# EAGLE design top_board_v1 (EAGLE 6.3)
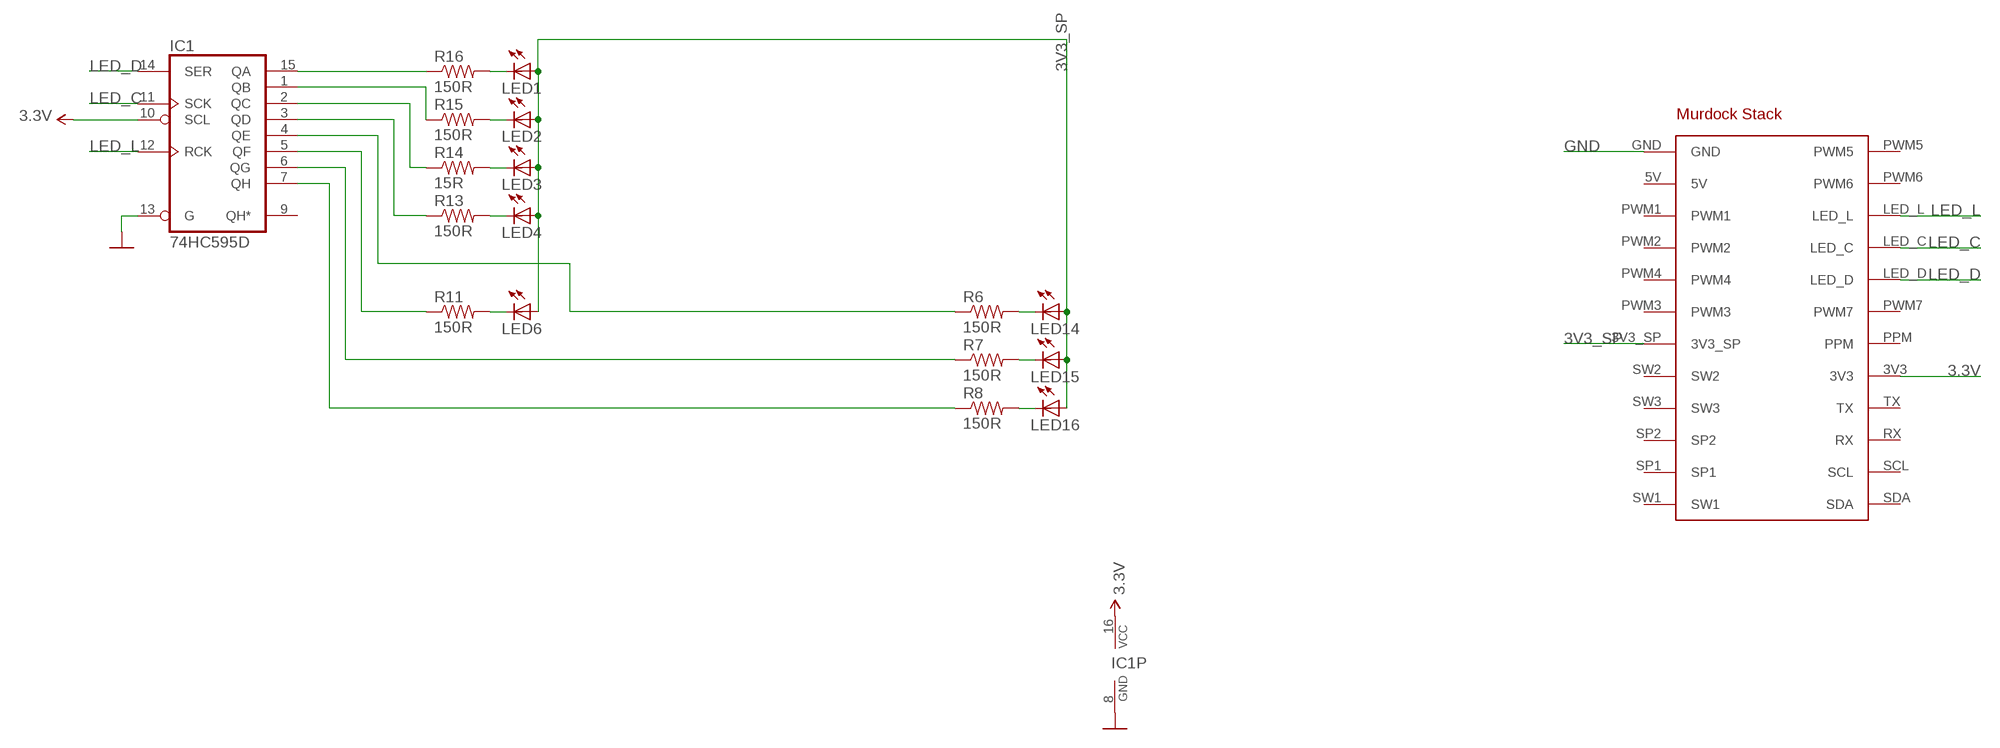
[diagram p0: schematic, sheet 1]

## Parts
IC1  74HC595D  [SO16]
LED1  LGM47K  [LGM47K]
LED2  LGM47K  [LGM47K]
LED3  LGM47K  [LGM47K]
LED4  LGM47K  [LGM47K]
LED6  LGM47K  [LGM47K]
LED14  LGM47K  [LGM47K]
LED15  LGM47K  [LGM47K]
LED16  LGM47K  [LGM47K]
R6  150R  RESISTOR0402-RES  [0402-RES]
R7  150R  RESISTOR0402-RES  [0402-RES]
R8  150R  RESISTOR0402-RES  [0402-RES]
R11  150R  RESISTOR0402-RES  [0402-RES]
R13  150R  RESISTOR0402-RES  [0402-RES]
R14  15R  RESISTOR0402-RES  [0402-RES]
R15  150R  RESISTOR0402-RES  [0402-RES]
R16  150R  RESISTOR0402-RES  [0402-RES]
X1  MURDOCK_STACK  [MURDOCK_STACK]

## Nets
3.3V: IC1.10(SCL) IC1.16(VCC) X1.3V3
3V3_SP: LED1.A LED2.A LED3.A LED4.A LED6.A LED14.A LED15.A LED16.A X1.3V3_SP
GND: IC1.8(GND) IC1.13(G) X1.GND
LED_C: IC1.11(SCK) X1.LED_C
LED_D: IC1.14(SER) X1.LED_D
LED_L: IC1.12(RCK) X1.LED_L
N$7: LED14.K(C) R6.2
N$8: LED15.K(C) R7.2
N$9: LED16.K(C) R8.2
N$10: LED1.K(C) R16.2
N$11: LED2.K(C) R15.2
N$12: LED3.K(C) R14.2
N$13: LED4.K(C) R13.2
N$15: LED6.K(C) R11.2
QA: IC1.15(QA) R16.1
QB: IC1.1(QB) R15.1
QC: IC1.2(QC) R14.1
QD: IC1.3(QD) R13.1
QE: IC1.4(QE) R6.1
QF: IC1.5(QF) R11.1
QG: IC1.6(QG) R7.1
QH: IC1.7(QH) R8.1
Unconnected: IC1.9(QH*) X1.5V X1.PPM X1.PWM1 X1.PWM2 X1.PWM3 X1.PWM4 X1.PWM5 X1.PWM6 X1.PWM7 X1.RX X1.SCL X1.SDA X1.SP1 X1.SP2 X1.SW1 X1.SW2 X1.SW3 X1.TX

## Library data of the parts
IC1 = 74xx-eu:74*595: 8-bit SHIFT REGISTER, output latch
LED1-LED4 LED6 LED14-LED16 = seb:LGM47K
R6-R8 R11 R13-R16 = SparkFun-Passives:RESISTOR: Resistor Basic schematic elements and footprints for 0603, 1206, and PTH resistors.
X1 = murdock:MURDOCK_STACK

## Board
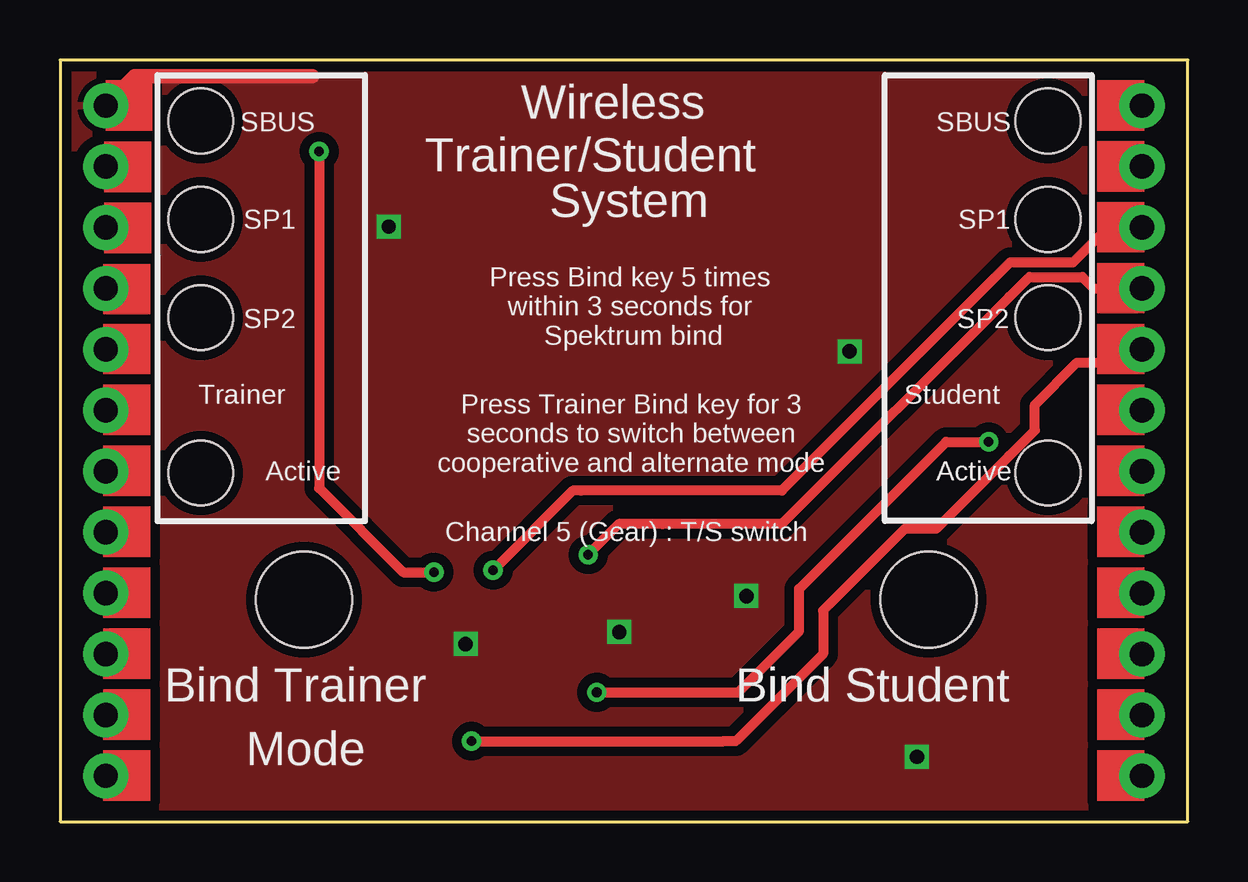
[diagram p1: board, top side]
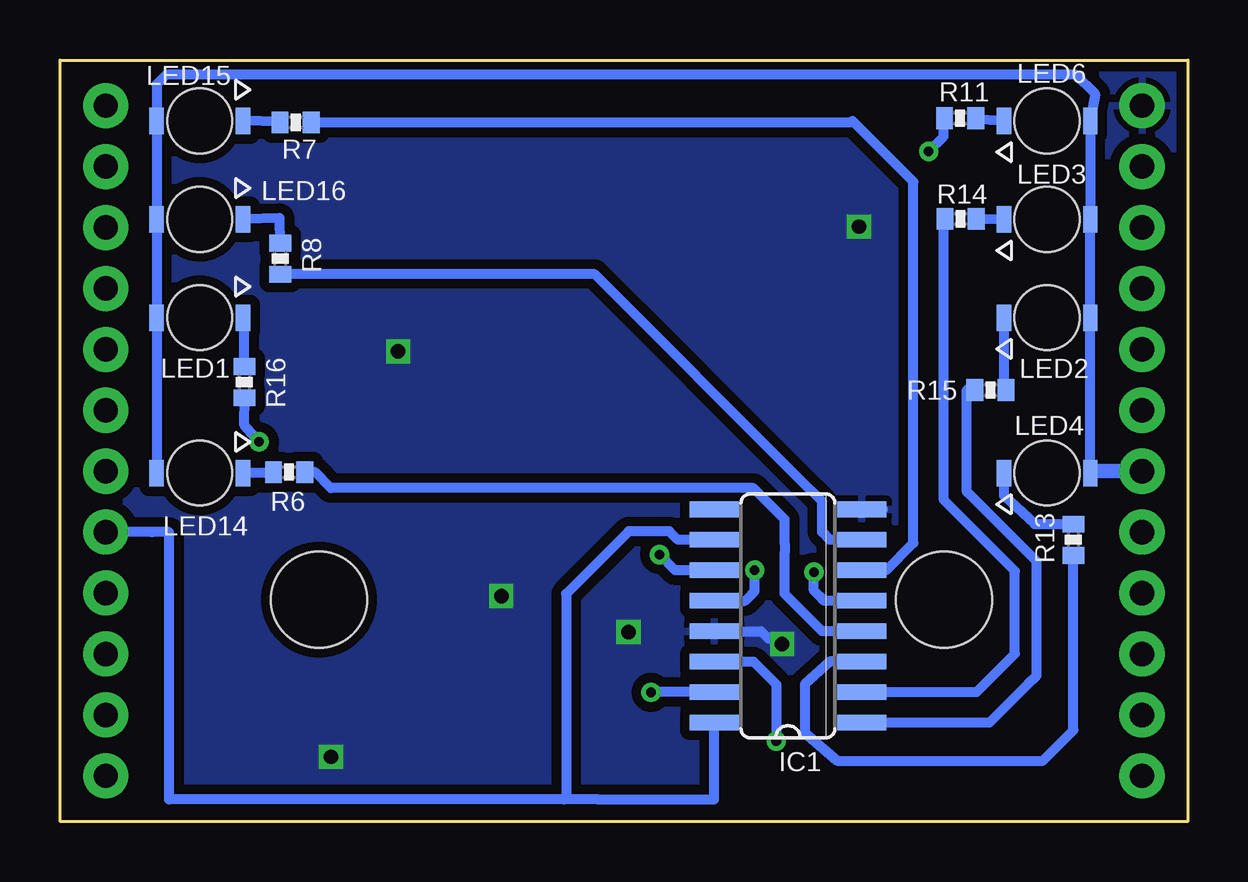
[diagram p2: board, bottom side, seen from below]

Size 46.99 x 31.75 mm. Coordinates in mm from the lower left corner, seen from the top.
Copper layers (1*16): Top 0.035mm / dielectric 1.5mm / Bottom 0.035mm
Design rules "default": minimum track width 10mil, minimum drill 0.4mm, track to track 8mil, track to pad 8mil, pad to pad 8mil, via to via 8mil, smd to smd 8mil, copper to edge 8mil, drill to drill 8mil, minimum pad ring 10mil, minimum via ring 8mil, stop-mask expansion 4mil, vias tented up to drill 30mil, thermal gap 10mil
Holes 4 mm at 10.16,9.26 36.2,9.26

### Footprints (pad centres in the part's own frame; a part is rotated, then mirrored left to right if it is on the bottom)
SO16 = smd 0.66 x 2.032: 1 -4.445,-3.073; 2 -3.175,-3.073; 3 -1.905,-3.073; 4 -0.635,-3.073; 5 0.635,-3.073; 6 1.905,-3.073; 7 3.175,-3.073; 8 4.445,-3.073; 9 4.445,3.073; 10 3.175,3.073; 11 1.905,3.073; 12 0.635,3.073; 13 -0.635,3.073; 14 -1.905,3.073; 15 -3.175,3.073; 16 -4.445,3.073
LGM47K = smd 0.6 x 1.1: A -1.8,0; K 1.8,0 | hole 2.7: 0,0
0402-RES = smd 0.7 x 0.9: 1 -0.65,0; 2 0.65,0
MURDOCK_STACK = drill 1.016 pad 1.88: 3V3 45.085,12.065; 3V3_SP 1.905,14.605; 5V 1.905,27.305; GND 1.905,29.845; LED_C 45.085,22.225; LED_D 45.085,19.685; LED_L 45.085,24.765; PPM 45.085,14.605; PWM1 1.905,24.765; PWM2 1.905,22.225; PWM3 1.905,17.145; PWM4 1.905,19.685; PWM5 45.085,29.845; PWM6 45.085,27.305; PWM7 45.085,17.145; RX 45.085,6.985; SCL 45.085,4.445; SDA 45.085,1.905; SP1 1.905,4.445; SP2 1.905,6.985; SW1 1.905,1.905; SW2 1.905,12.065; SW3 1.905,9.525; TX 45.085,9.525

### Placement (x,y rotation side)
IC1  16.66,8.57 90 bottom
LED1  41.16,21.01 0 bottom
LED2  5.87,21.01 180 bottom
LED3  5.87,25.11 180 bottom
LED4  5.87,14.53 180 bottom
LED6  5.87,29.21 180 bottom
LED14  41.16,14.53 0 bottom
LED15  41.16,29.21 0 bottom
LED16  41.16,25.11 0 bottom
R6  37.45,14.56 180 bottom
R7  37.17,29.14 180 bottom
R8  37.81,23.46 90 bottom
R11  9.49,29.32 0 bottom
R13  4.76,11.75 90 bottom
R14  9.46,25.12 0 bottom
R15  8.22,17.99 0 bottom
R16  39.3,18.32 90 bottom
X1  0,0 0 top

### Tracks (layer width: path | path; a pad name or v marks a point on that pad's centre or on a via)
3.3V
  Bottom 0.406: X1.3V3 43.16,12.06 42.44,12.06 42.44,0.92 26,0.92 | 26,0.92 24.57,0.92 24.15,0.92 | 24.15,0.92 19.73,0.92 IC1.16 | 24.36,0.92 24.15,0.92 | IC1.10 21.25,11.75 21.6,12.1 23.3,12.1 25.9,9.5 25.9,1.02 26,0.92
3V3_SP
  Bottom 0.406: LED4.A LED2.A LED3.A LED6.A 3.87,30.34 4.67,31.14 42.56,31.14 42.97,30.73 LED15.A LED16.A LED1.A LED14.A
  Bottom 0.61: X1.3V3_SP 4.07,14.61 LED4.A
GND  (via drill 0.6)
  Top 0.61: X1.GND 3.12,31.06 10.52,31.06
  Bottom 0.406: IC1.13 17.78,7.94 17.46,7.62 | IC1.8 12.7,13.02
  other vias: 13.7,24.8 16.9,7.4 32.9,19.6 28.6,9.4 35.7,2.7 23.3,7.9
  pour Top (isolate 0.406): -0.64,32.38 -0.64,-0.64 47.31,-0.64 47.31,32.38
  pour Bottom (isolate 0.406): -0.64,32.38 -0.64,-0.64 47.31,-0.64 47.31,32.38
LED_C  (via drill 0.4)
  Top 0.406: X1.LED_C 43.08,22.23 42.6,22.71 40.39,22.71 39.55,21.87 30.08,12.4 25.1,12.4 23.28,12.4 v22.01,11.13
  Bottom 0.406: IC1.11 21.36,10.48 v22.01,11.13
LED_D  (via drill 0.4)
  Top 0.406: X1.LED_D 44.53,19.13 42.37,19.13 40.62,17.37 40.62,16.31 39.55,15.24 36.51,12.2 35.2,12.2 31.8,8.8 31.8,7 28.15,3.35 27.65,3.35 v17.14,3.35
  Bottom 0.406: IC1.14 18.1,6.67 17.14,5.71 v17.14,3.35
LED_L  (via drill 0.4)
  Top 0.406: X1.LED_L 43.66,24.77 42.22,23.32 39.6,23.32 30.08,13.8 21.7,13.8 21.37,13.8 v18.05,10.48
  Bottom 0.406: IC1.12 18.44,9.21 18.15,9.5 18.05,9.61 v18.05,10.48
N$7
  Bottom 0.406: R6.2 38.13,14.53 LED14.K
N$8
  Bottom 0.406: R7.2 37.86,29.18 LED15.K
N$9
  Bottom 0.406: R8.2 37.84,25.16 LED16.K
N$10
  Bottom 0.406: R16.2 39.3,20.97 LED1.K
N$11
  Bottom 0.406: LED2.K 7.67,17.94 7.55,18.03 R15.2
N$12
  Bottom 0.406: LED3.K 8.62,25.09 R14.2
N$13
  Bottom 0.406: LED4.K 7.67,13.59 6.38,12.4 R13.2
N$15
  Bottom 0.406: LED6.K 8.91,29.26 R11.2
QA  (via drill 0.4)
  Top 0.406: v22.36,5.38 22.41,5.38 28.25,5.38 30.8,7.93 30.8,9.7 36.93,15.83 v38.7,15.83
  Bottom 0.406: IC1.15 22.35,5.4 v22.36,5.38 | R16.1 39.33,16.56 v38.7,15.83
QB
  Bottom 0.406: IC1.1 8.26,4.13 6.67,5.71 6.3,6.08 6.3,10.85 9.21,13.76 | 9.21,13.76 9.21,13.73 9.21,13.76 | 9.21,13.76 9.21,18.01 R15.1
QC
  Bottom 0.406: IC1.2 9.21,5.4 8.8,5.4 7.2,7 7.2,10.44 10.16,13.4 10.16,24.75 R14.1
QD
  Bottom 0.406: IC1.3 14.92,6.67 15.96,5.73 15.96,3.69 14.61,2.54 6.03,2.54 4.76,3.81 R13.1
QE
  Bottom 0.406: IC1.4 15.24,7.94 16.8,9.5 16.8,9.8 16.8,11.2 16.8,11.6 16.8,12.6 18.1,13.9 35.7,13.9 36.37,14.56 R6.1
QF  (via drill 0.4)
  Top 0.406: v10.79,27.94 10.79,13.9 14.3,10.39 v15.58,10.39
  Bottom 0.406: v10.79,27.94 10.18,28.56 R11.1 | IC1.5 15.16,9.21 15.35,9.4 15.58,9.63 v15.58,10.39
QG
  Bottom 0.406: IC1.6 12.56,10.48 11.43,11.61 11.43,26.67 13.97,29.21 14.04,29.14 R7.1
QH
  Bottom 0.406: 37.77,22.86 R8.1 24.71,22.82 16.2,14.3 15.24,13.34 15.24,12.06 14.92,11.75 IC1.7
(copper drawn outside any net)
  shapes: Top area x26

### Text on the board
tPlace: SBUS | SBUS | Wireless | Trainer/Student | SP1 | SP1 | System | Press Bind key 5 times / within 3 seconds for / Spektrum bind | SP2 | SP2 | Trainer | Student | Press Trainer Bind key for 3 / seconds to switch between / cooperative and alternate mode | Active | Active | Channel 5 (Gear) : T/S switch | Bind Trainer | Bind Student | Mode